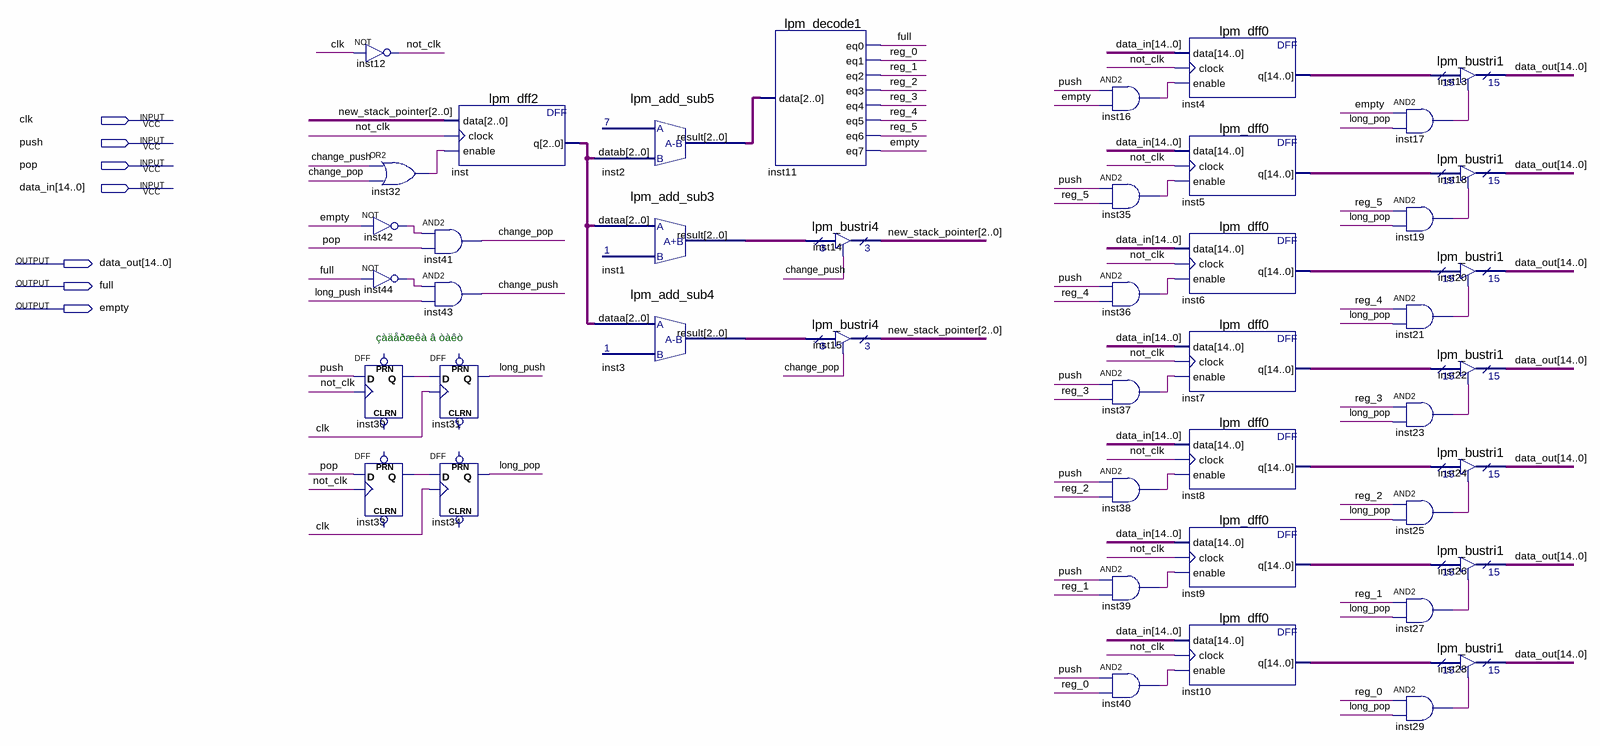
[diagram p0: schematic sheet]
// Quartus schematic stack.bdf as structural Verilog: 45 symbols, 7 pins
module stack (
  input  clk,
  input  push,
  input  pop,
  input  [14:0] data_in,
  output [14:0] data_out,
  output full,
  output empty
);

  wire change_pop, change_push, inst16_out, inst17_out, inst19_out, inst21_out, inst23_out, inst25_out,
       inst27_out, inst29_out, inst30_q, inst32_out, inst33_q, inst35_out, inst36_out, inst37_out,
       inst38_out, inst39_out, inst40_out, inst42_out, inst44_out, long_pop, long_push, not_clk, reg_0,
       reg_1, reg_2, reg_3, reg_4, reg_5;
  wire [2:0] inst1_result, inst2_result, inst3_result, inst_q, new_stack_pointer;
  wire [14:0] inst4_q, inst5_q, inst6_q, inst7_q, inst8_q, inst9_q, inst10_q;

  not inst12 (not_clk, clk);
  DFF inst30 (.CLK(not_clk), .D(push), .Q(inst30_q));  // open: CLRN, PRN
  DFF inst33 (.CLK(not_clk), .D(pop), .Q(inst33_q));  // open: CLRN, PRN
  or inst32 (inst32_out, change_push, change_pop);
  not inst42 (inst42_out, empty);
  not inst44 (inst44_out, full);
  lpm_dff2 inst (.data(new_stack_pointer), .clock(not_clk), .enable(inst32_out), .q(inst_q));
  and inst41 (change_pop, inst42_out, pop);
  and inst43 (change_push, inst44_out, long_push);
  DFF inst31 (.CLK(clk), .D(inst30_q), .Q(long_push));  // open: CLRN, PRN
  DFF inst34 (.CLK(clk), .D(inst33_q), .Q(long_pop));  // open: CLRN, PRN
  lpm_add_sub5 inst2 (.datab(inst_q), .result(inst2_result));
  lpm_add_sub3 inst1 (.dataa(inst_q), .result(inst1_result));
  lpm_add_sub4 inst3 (.dataa(inst_q), .result(inst3_result));
  lpm_decode1 inst11 (
    .data(inst2_result), .eq0(full), .eq1(reg_0), .eq2(reg_1), .eq3(reg_2), .eq4(reg_3), .eq5(reg_4),
    .eq6(reg_5), .eq7(empty));
  lpm_bustri4 inst14 (.enabledt(change_push), .data(inst1_result), .tridata(new_stack_pointer));
  lpm_bustri4 inst15 (.enabledt(change_pop), .data(inst3_result), .tridata(new_stack_pointer));
  and inst16 (inst16_out, push, empty);
  and inst35 (inst35_out, push, reg_5);
  and inst36 (inst36_out, push, reg_4);
  and inst37 (inst37_out, push, reg_3);
  and inst38 (inst38_out, push, reg_2);
  and inst39 (inst39_out, push, reg_1);
  and inst40 (inst40_out, push, reg_0);
  lpm_dff0 inst4 (.data(data_in), .clock(not_clk), .enable(inst16_out), .q(inst4_q));
  lpm_dff0 inst5 (.data(data_in), .clock(not_clk), .enable(inst35_out), .q(inst5_q));
  lpm_dff0 inst6 (.data(data_in), .clock(not_clk), .enable(inst36_out), .q(inst6_q));
  lpm_dff0 inst7 (.data(data_in), .clock(not_clk), .enable(inst37_out), .q(inst7_q));
  lpm_dff0 inst8 (.data(data_in), .clock(not_clk), .enable(inst38_out), .q(inst8_q));
  lpm_dff0 inst9 (.data(data_in), .clock(not_clk), .enable(inst39_out), .q(inst9_q));
  lpm_dff0 inst10 (.data(data_in), .clock(not_clk), .enable(inst40_out), .q(inst10_q));
  lpm_bustri1 inst13 (.enabledt(inst17_out), .data(inst4_q), .tridata(data_out));
  and inst17 (inst17_out, empty, long_pop);
  lpm_bustri1 inst18 (.enabledt(inst19_out), .data(inst5_q), .tridata(data_out));
  and inst19 (inst19_out, reg_5, long_pop);
  lpm_bustri1 inst20 (.enabledt(inst21_out), .data(inst6_q), .tridata(data_out));
  and inst21 (inst21_out, reg_4, long_pop);
  lpm_bustri1 inst22 (.enabledt(inst23_out), .data(inst7_q), .tridata(data_out));
  and inst23 (inst23_out, reg_3, long_pop);
  lpm_bustri1 inst24 (.enabledt(inst25_out), .data(inst8_q), .tridata(data_out));
  and inst25 (inst25_out, reg_2, long_pop);
  lpm_bustri1 inst26 (.enabledt(inst27_out), .data(inst9_q), .tridata(data_out));
  and inst27 (inst27_out, reg_1, long_pop);
  lpm_bustri1 inst28 (.enabledt(inst29_out), .data(inst10_q), .tridata(data_out));
  and inst29 (inst29_out, reg_0, long_pop);

  // Notes on the sheet:
  //   çàäåðæêà â òàêò
endmodule
